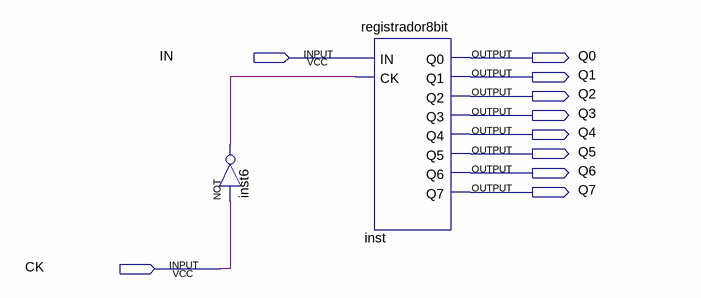
[diagram p0: schematic sheet]
// Quartus schematic main.bdf as structural Verilog: 2 symbols, 10 pins
module main (
  input  IN,
  input  CK,
  output Q0,
  output Q1,
  output Q2,
  output Q3,
  output Q4,
  output Q5,
  output Q6,
  output Q7
);

  wire inst6_out;

  not inst6 (inst6_out, CK);
  registrador8bit inst (
    .IN(IN), .CK(inst6_out), .Q0(Q0), .Q1(Q1), .Q2(Q2), .Q3(Q3), .Q4(Q4), .Q5(Q5), .Q6(Q6), .Q7(Q7));
endmodule
